# Altium schematic sheet MCU.SchDoc
size A4; SheetNumber: 2; SheetTotal: 4
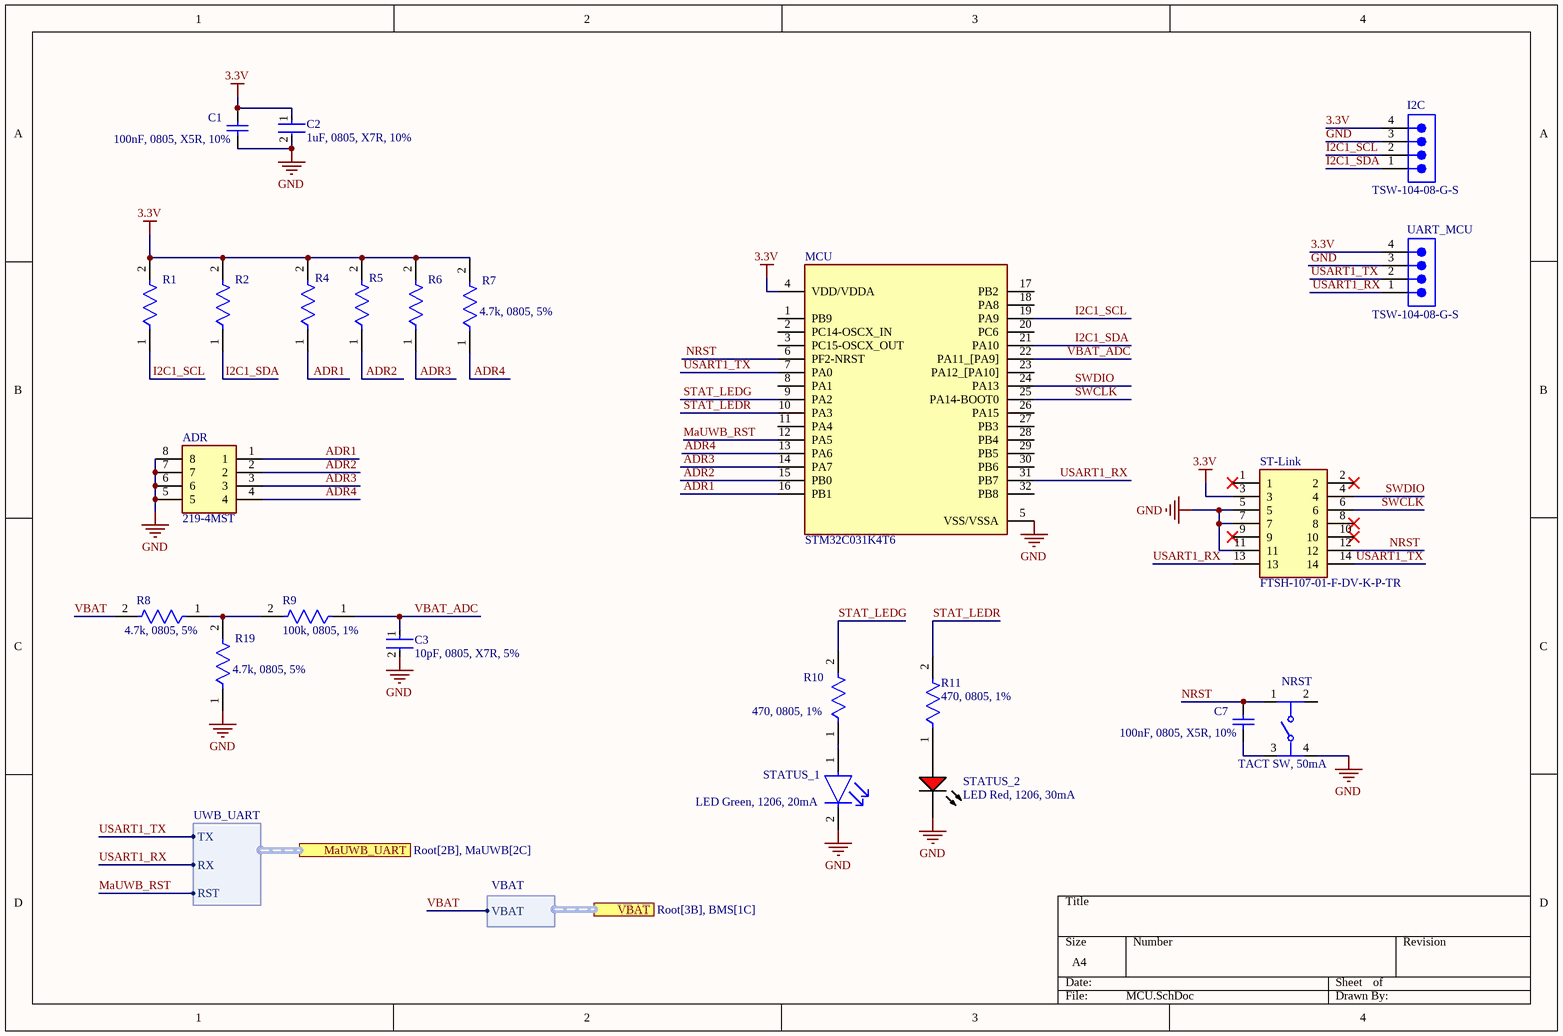
[diagram p0: MCU.SchDoc]

## Parts
ADR  219-4MST  [2194MST]
C1  100nF, 0805, X5R, 10%  [CAPC2013X140X50ML20T25]
C2  1uF, 0805, X7R, 10%  [FP-CC0805-0_85-MFG]
C3  10pF, 0805, X7R, 5%  [FP-C0805C-DN-MFG]
C7  100nF, 0805, X5R, 10%  [CAPC2013X140X50ML20T25]
I2C  TSW-104-08-G-S  [SMTC-TSW-104-08-X-S]
MCU  STM32C031K4T6  [QFP80P900X900X160-32N]
NRST  TACT SW, 50mA  [FP-PTS647SK38SMTR2LFS-MFG]
R1  (no value)  [FP-RMCF0805-MFG]
R2  (no value)  [FP-RMCF0805-MFG]
R4  (no value)  [FP-RMCF0805-MFG]
R5  (no value)  [FP-RMCF0805-MFG]
R6  (no value)  [FP-RMCF0805-MFG]
R7  4.7k, 0805, 5%  [FP-RMCF0805-MFG]
R8  4.7k, 0805, 5%  [FP-RMCF0805-MFG]
R9  100k, 0805, 1%  [FP-CRGCQ0805-IPC_C]
R10  470, 0805, 1%  [FP-RMCF0805-IPC_C]
R11  470, 0805, 1%  [FP-RMCF0805-IPC_C]
R19  4.7k, 0805, 5%  [FP-RMCF0805-MFG]
ST-Link  FTSH-107-01-F-DV-K-P-TR  [FTSH-107-XX-YYY-DV-K-P-TR]
STATUS_1  LED Green, 1206, 20mA  [FP-SML-LX1206GC-TR-MFG]
STATUS_2  LED Red, 1206, 30mA  [LUMX-SML-LX1206IC_V]
UART_MCU  TSW-104-08-G-S  [SMTC-TSW-104-08-X-S]

## Ports
MaUWB_UART (harness UWB_UART, see Root[2B], MaUWB[2C]), VBAT (harness VBAT, see Root[3B], BMS[1C])

## Harnesses
VBAT: VBAT
UWB_UART: TX, RX, RST

## Nets
3.3V: C1.2 C2.1 I2C.4 MCU.4(VDD/VDDA) R1.2 R2.2 R4.2 R5.2 R6.2 R7.2 ST-Link.3 UART_MCU.4
GND: ADR.5 ADR.6 ADR.7 ADR.8 C1.1 C2.2 C3.2 I2C.3 MCU.5(VSS/VSSA) NRST.4 R19.1 ST-Link.5 ST-Link.7 ST-Link.11 STATUS_1.2(C) STATUS_2.2(K) UART_MCU.3
ADR1: ADR.1 MCU.16(PB1) R4.1
ADR2: ADR.2 MCU.15(PB0) R5.1
ADR3: ADR.3 MCU.14(PA7) R6.1
ADR4: ADR.4 MCU.13(PA6) R7.1
I2C1_SCL: I2C.2 MCU.19(PA9) R1.1
I2C1_SDA: I2C.1 MCU.21(PA10) R2.1
MaUWB_RST: MCU.12(PA5) ; port MaUWB_UART.RST
NRST: C7.2 MCU.6(PF2-NRST) NRST.1 ST-Link.12
STAT_LEDG: MCU.9(PA2) R10.2
STAT_LEDR: MCU.10(PA3) R11.2
SWCLK: MCU.25(PA14-BOOT0) ST-Link.6
SWDIO: MCU.24(PA13) ST-Link.4
USART1_RX: MCU.31(PB7) ST-Link.13 UART_MCU.1 ; port MaUWB_UART.RX
USART1_TX: MCU.7(PA0) ST-Link.14 UART_MCU.2 ; port MaUWB_UART.TX
VBAT: R8.2 ; port VBAT.VBAT
VBAT_ADC: C3.1 MCU.22(PA11_[PA9]) R9.1
NetC7_1: C7.1 NRST.3
NetR8_1: R8.1 R9.2 R19.2
NetR10_1: R10.1 STATUS_1.1(A)
NetR11_1: R11.1 STATUS_2.1(A)

Not connected (* = marked no-connect by the designer): MCU 1(PB9) 2(PC14-OSCX_IN) 3(PC15-OSCX_OUT) 8(PA1) 11(PA4) 17(PB2) 18(PA8) 20(PC6) 23(PA12_[PA10]) 26(PA15) 27(PB3) 28(PB4) 29(PB5) 30(PB6) 32(PB8); NRST 2; ST-Link 1* 2* 8* 9* 10*

## Library data of the parts
ADR = 219-4MST: Switch; Manufacturer_Name: CTS; Datasheet Link: https://componentsearchengine.com/Datasheets/1/219-4MST.pdf; Height: 4.3mm; Manufacturer_Part_Number: 219-4MST; Mouser Part Number: 774-2194MST; Mouser Price/Stock: https://www.mouser.co.uk/ProductDetail/CTS-Electronic-Components/219-4MST?qs=qNzHFtQhdJ8xGV2Z9mul9A%3D%3D; Arrow Part Number: 219-4MST; Arrow Price/Stock: https://www.arrow.com/en/products/219-4mst/cts
C1 C7 = CMP-2007-04689-1: Part Number: 08055D104KAT2A; Manufacturer: AVX Interconnect / Elco
C2 = CMP-03422-001015-1: CC0805 1 uF X7R 10.00% 50 V; Manufacturer Part Number: CC0805KFX7R9BB105; Manufacturer: Yageo; Material: Ceramic; Tolerance: 0.1; Voltage Rating: 50 V; Device Class L1: Passive Components; Ipc Land Pattern Name: CAPC200125X85; Temperature Range High: +85°C; ComponentLink2Description: Datasheet; Automotive: No; Temperature Range Low: -30°C; Height: 0.95mm; Device Class L2: Capacitors; Value: 1 uF; Octopart: https://octopart.com/cc0805kfx7r9bb105-yageo-76378930; Temperature Characteristic: X7R; Category: Cap; RoHS: TRUE; ComponentLink2URL: http://www.yageo.com/documents/recent/UPY-GPHC_Y5V_6.3V-to-50V_8.pdf; Package: CC0805-0.85; Footprint Url: http://www.yageo.com/exep/pages/download/literatures/UPY-C_GEN_24.pdf; Capacitance: 1 uF; Temperature: -30°C to +85°C; Lead Free: Yes; Mouser Description: Cap Ceramic 1uF 50VDC X7R 10% SMD 0805 125°C BP; Device Class L3: Ceramic Capacitors
C3 = CMP-03020-021676-1: C0805 10 pF X7R 30ppm/°C 5.00% 50 V; Manufacturer Part Number: C0805C100J5RACTU; Manufacturer: KEMET; Material: Ceramic; Voltage Rating: 50 V; Tolerance: 0.05; ComponentLink2URL: https://content.kemet.com/datasheets/KEM_C1003_C0G_SMD.pdf; Device Class L2: Capacitors; Octopart: https://octopart.com/c0805c100j5ractu-kemet-81794931; Height: 0.88mm; Ipc Land Pattern Name: CAPC200125X78; ComponentLink2Description: Datasheet; Temperature Range Low: -55°C; Automotive: No; Category: Cap; Value: 10 pF; Device Class L3: Ceramic Capacitors; Device Class L1: Passive Components; Capacitance: 10 pF; Temperature Coefficient: 30ppm/°C; Temperature Range High: +125°C; Lead Free: Yes; Package: C0805C-DN; Temperature: -55°C to +125°C; Mouser Description: Cap, 10PF, 50V, Mlcc, 0805; RoHS: TRUE; Temperature Characteristic: X7R
I2C UART_MCU = CMP-1024-00357-1: 0.025" SQ Post Header, Through-hole, Vertical, -55 to 125 degC, 2.54 mm Pitch, 4-Pin, Male, RoHS; Manufacturer: Samtec; Pitch: 2.54 mm; RoHS: True; ComponentLink3URL: http://www.samtec.com/documents/webfiles/cpdf/TSW-XXX-XX-XXX-X-XX-XXX-MKT.pdf; Mounting Technology: Through-hole; ComponentLink2URL: http://www.samtec.com/documents/webfiles/pdf/TSW_TH.PDF; ComponentLink1URL: http://www.samtec.com; ComponentLink3Description: Package Specification; PackageVersion: DM, 8/1988; ComponentLink2Description: Datasheet; PackageReference: TSW-104-08-X-S; PackageDescription: .025[0.64] SQ. Post Terminal Strip Assembly; PartNumber: TSW-104-08-G-S; ComponentLink1Description: Manufacturer URL; Temperature Range: -55 to 125 degC; DatasheetVersion: F-214; Orientation: Vertical
MCU = STM32C031K4T6: Integrated Circuit; Manufacturer_Name: STMicroelectronics; Datasheet Link: https://www.st.com/resource/en/datasheet/stm32c031c4.pdf; Height: 1.6mm; Manufacturer_Part_Number: STM32C031K4T6; Mouser Part Number: 511-STM32C031K4T6; Mouser Price/Stock: https://www.mouser.co.uk/ProductDetail/STMicroelectronics/STM32C031K4T6?qs=IPgv5n7u5QbiXsG7yxbPWw%3D%3D; Arrow Part Number: STM32C031K4T6; Arrow Price/Stock: https://www.arrow.com/en/products/stm32c031k4t6/stmicroelectronics?region=nac
NRST = CMP-10040-000033-1: TACT 4.5 X 4.5, 3.8 MM H, 2.5N,; Switch Function: Off-Mom; Switch Travel: 0.25mm; Actuator Type: Standard; Illumination Type: Non-Illuminated; Mechanical Life: 100000Cycles; Ratings: IP40; Operating Force: 250gf; Throw Configuration: SPST; Max Operating Temperature: 70°C; Min Operating Temperature: -20°C; Termination: Gull Wing; Mount: Surface Mount; Packaging: Tape and Reel
R1 R2 R4-R8 R19 = CMP-26527-004085-1: 4.7kΩ ±5% 0.125W 0805 Thick Film Chip Resistor AEC-Q200 compliant; Temperature Coefficient: 200ppm/°C; Max Power Dissipation: 125mW; Resistance: 4.7kR; RoHS Compliant: Yes; Package Quantity: 10000; Packaging: Tape and Reel; Contact Plating: Tin; Radiation Hardening: No; Mount: Surface Mount; Height: 0.026inch; Case Code (Metric): 2012; Tolerance: 5%; Case/Package: 0805; Width: 0.049inch; Series: RMCF; Case Code (Imperial): 0805; Number of Terminations: 2; Min Operating Temperature: -55°C; Resistor Type: Thick Film; Max Operating Temperature: 155°C; Length: 0.079inch; Features: Automotive AEC-Q200
R9 = CMP-03211-000816-1: CRGCQ 0805 100K 1%; Manufacturer: TE Connectivity; Manufacturer Part Number: CRGCQ0805F100K; Tolerance: 0.01; Power Rating: 0.125W; Resistance: 100KΩ; Value: 100KΩ; Temperature Coefficient: ±100ppm/°C; Voltage Rating: 150V; RoHS: TRUE; ComponentLink2URL: https://www.te.com/commerce/DocumentDelivery/DDEController?Action=showdoc&DocId=Data+Sheet%7F1773204-3%7F1%7Fpdf%7FEnglish%7FENG_DS_1773204-3_1.pdf%7F4-2176341-1150; Category: Res; Device Class L2: Resistors; Height: 0.65mm; Ambient Temperature Range High: +70°C; Ipc Land Pattern Name: RESC200125X55; Octopart: https://octopart.com/crgcq0805f100k-te+connectivity-91018138; Digikey Description: CRGCQ 0805 100K 1%; Temperature Range High: +155°C; Lead Free: Yes; Automotive: Yes; Temperature Range Low: -55°C; Device Class L1: Passive Components; Device Class L3: Chip SMD Resistors; Mouser Description: Res Thick Film 0805 100K Ohm 1% 0.125W(1/8W) ±100ppm/C Pad SMD Automotive T/R; Temperature: -55°C to +155°C; Composition: Thick Film; ComponentLink2Description: Datasheet; Automotive Grade: Grade 1141; Package: CRGCQ0805; Series: CRGCQ
R10 R11 = CMP-26527-003746-1: 470Ω ±1% 0.125W 0805 Thick Film Chip Resistor AEC-Q200 compliant; Resistance: 470R; Temperature Coefficient: 100ppm/°C; Max Power Dissipation: 125mW; Resistor Type: Thick Film; Number of Terminations: 2; Packaging: Tape and Reel; RoHS Compliant: Yes; Case/Package: 0805; Mount: Surface Mount; Contact Plating: Tin; Series: RMCF; Min Operating Temperature: -55°C; Radiation Hardening: No; Features: Automotive AEC-Q200; Tolerance: 1%; Max Operating Temperature: 155°C
ST-Link = FTSH-107-01-F-DV-K-P-TR: Connector; Manufacturer_Name: SAMTEC; Datasheet Link: http://suddendocs.samtec.com/prints/ftsh-1xx-xx-xxx-dv-xxx-xxx-mkt.pdf; Manufacturer_Part_Number: FTSH-107-01-F-DV-K-P-TR; Mouser Part Number: 200-FTSH10701FDVKPTR; Mouser Price/Stock: https://www.mouser.co.uk/ProductDetail/Samtec/FTSH-107-01-F-DV-K-P-TR?qs=%252BZP6%2F%252BtExtAI0atx6lcXTg%3D%3D; Arrow Part Number: FTSH-107-01-F-DV-K-P-TR; Arrow Price/Stock: https://www.arrow.com/en/products/ftsh-107-01-f-dv-k-p-tr/samtec?utm_currency=USD&region=nac
STATUS_1 = CMP-2000-07122-2: LED GREEN CLEAR 1206 SMD; Luminous Intensity: 10mcd; Forward Voltage: 2.2V; Viewing Angle: 160°; Lens Color: Colorless; Approvals: UL; Dominant Wavelength: 565nm; Current Rating: 25mA; Number of LEDs: 1; Power Rating: 65mW; Lens Style: Rectangular; Test Current: 20mA; Length: 3.2mm; Mount: Surface Mount; Package Quantity: 1; Forward Current: 20mA; Case/Package: 1206; Lead Free: Lead Free; Case Code (Imperial): 1206; Max Operating Temperature: 85°C; REACH SVHC: No SVHC; RoHS Compliant: Yes; Number of Pins: 2; Illumination Color: Green; Width: 1.6mm; Packaging: Tape and Reel; Wavelength: 565nm; Lens Transparency: Clear; Height: 1.1mm; Color: Green; Min Operating Temperature: -40°C; Case Code (Metric): 3216
STATUS_2 = CMP-2000-07123-1: LED Red, 65 mW, -40 to 85 degC, 2-Pin SMD, RoHS, Tape and Reel; Manufacturer: Lumex; Part No: SML-LX1206IC-TR; LED Material: GaAsP; Peak Wavelength: 635nm; Number of LEDs: 1; Viewing Angle: 160; Reverse Voltage: 5(Min)V; Lens Appearance: ColorlessNonDiffused; Intensity: 6mcd; Pin_Count: 2; Lens Dimensions: 2x1.6x0.5mm; Mounting: SurfaceMount; ECCN: EAR99; RoHS: Unknown; Package Description: 2-Pin Surface Mount Device, Body 3.2 x 1.5 mm; Mounting Technology: SurfaceMount; Dominant Wavelength: N/A; Supplier_Package: SMD; Supplier Standard Pack: 3,000; Color: Red; Dimension: 3.2x1.6x1.1mm; HTS: 8541402000; Family: SML-LX1206IC; Supplier: Lumex; Datasheet URL: http://www.lumex.com/content/files/ProductAttachment/SML-LX1206IC-TR.pdf; Package Reference: SML-LX1206IC; Manufacturer URL: http://www.lumexinstruments.com/; Type: Uni-Color; Operating Temperature: -25to85C; Packaging: TapeandReel; Datasheet Version: Rev. J, 08/2012